# EAGLE design new_power2 (EAGLE 6.4)
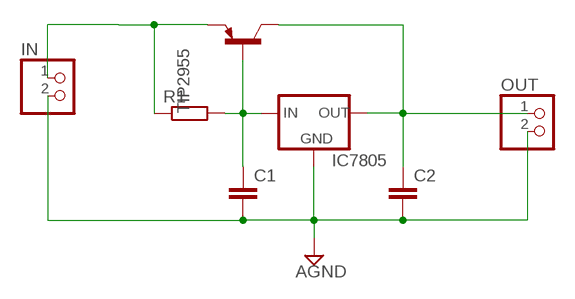
[diagram p0: schematic, sheet 1]

## Parts
C1  C-EU025-024X044  [C025-024X044]
C2  C-EU025-024X044  [C025-024X044]
IC7805  78XXL  [78XXL]
IN  PINHD-1X2  [1X02]
OUT  PINHD-1X2  [1X02]
R1  R-EU_0204/5  [0204/5]
TIP2955  -PNP-TO220  [TO220]

## Nets
AGND: C1.2 C2.2 IC7805.GND IN.2 OUT.2
N$1: IN.1 R1.1 TIP2955.3(E)
N$2: C1.1 IC7805.IN R1.2 TIP2955.1(B)
N$3: C2.1 IC7805.OUT OUT.1 TIP2955.2(C)

## Library data of the parts
C1 C2 = rcl:C-EU: CAPACITOR, European symbol
IC7805 = v-reg:78XXL: VOLTAGE REGULATOR
IN OUT = pinhead:PINHD-1X2: PIN HEADER
R1 = rcl:R-EU_: RESISTOR, European symbol
TIP2955 = transistor:*-PNP-: PNP Transistror

## Board
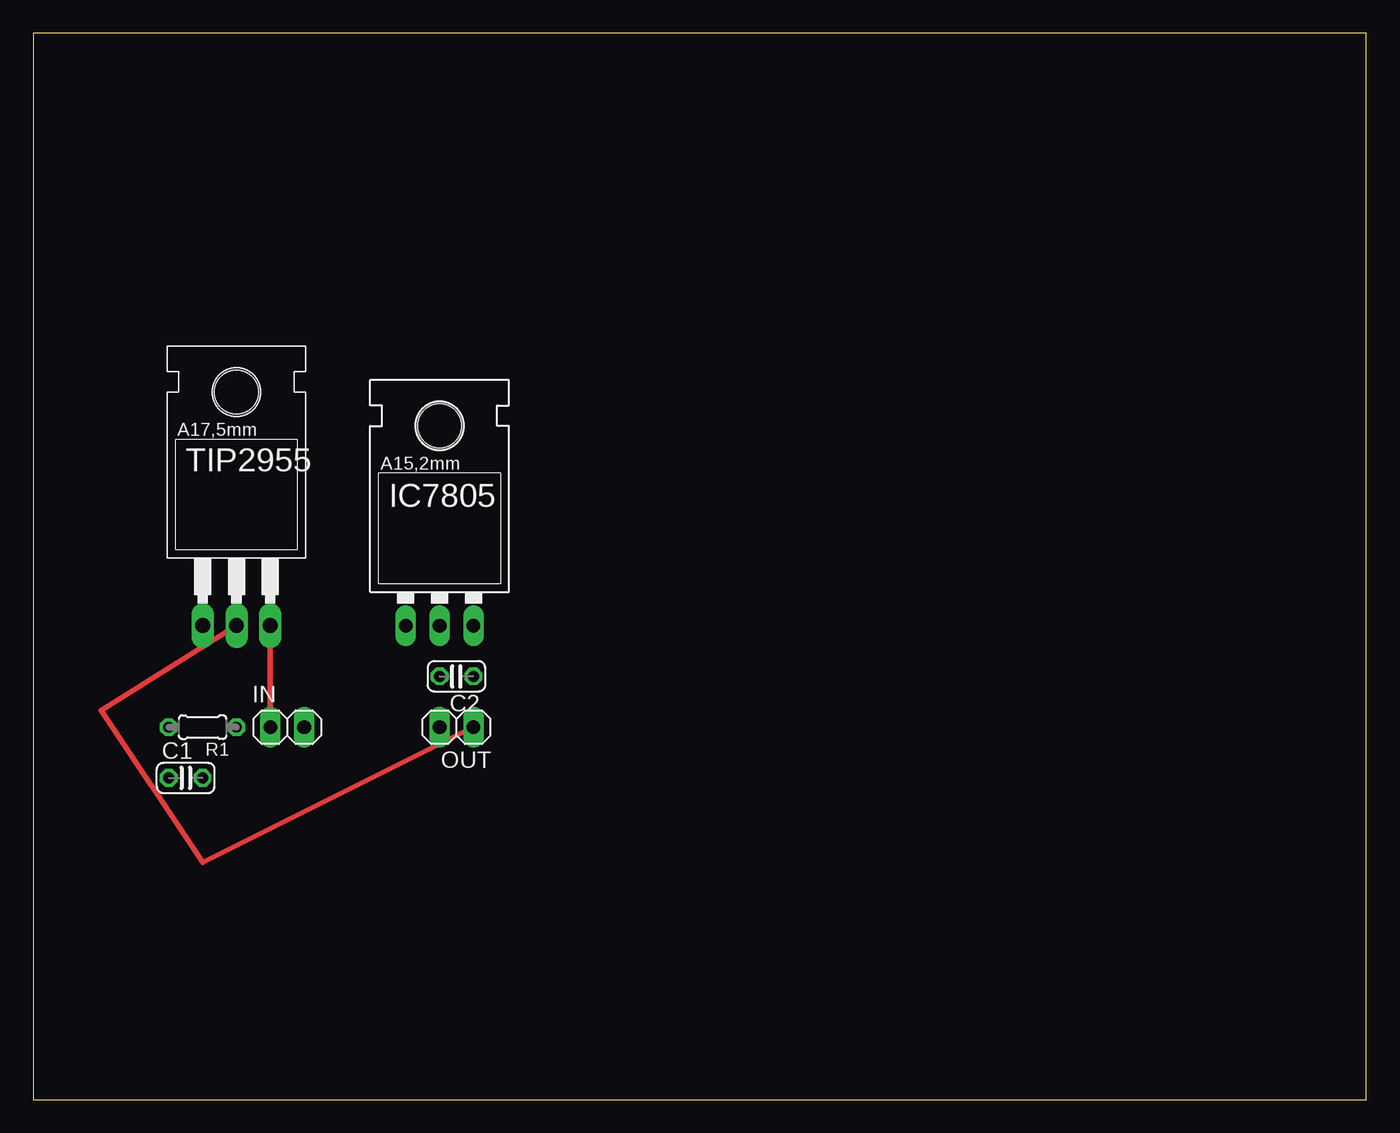
[diagram p1: board, top side]
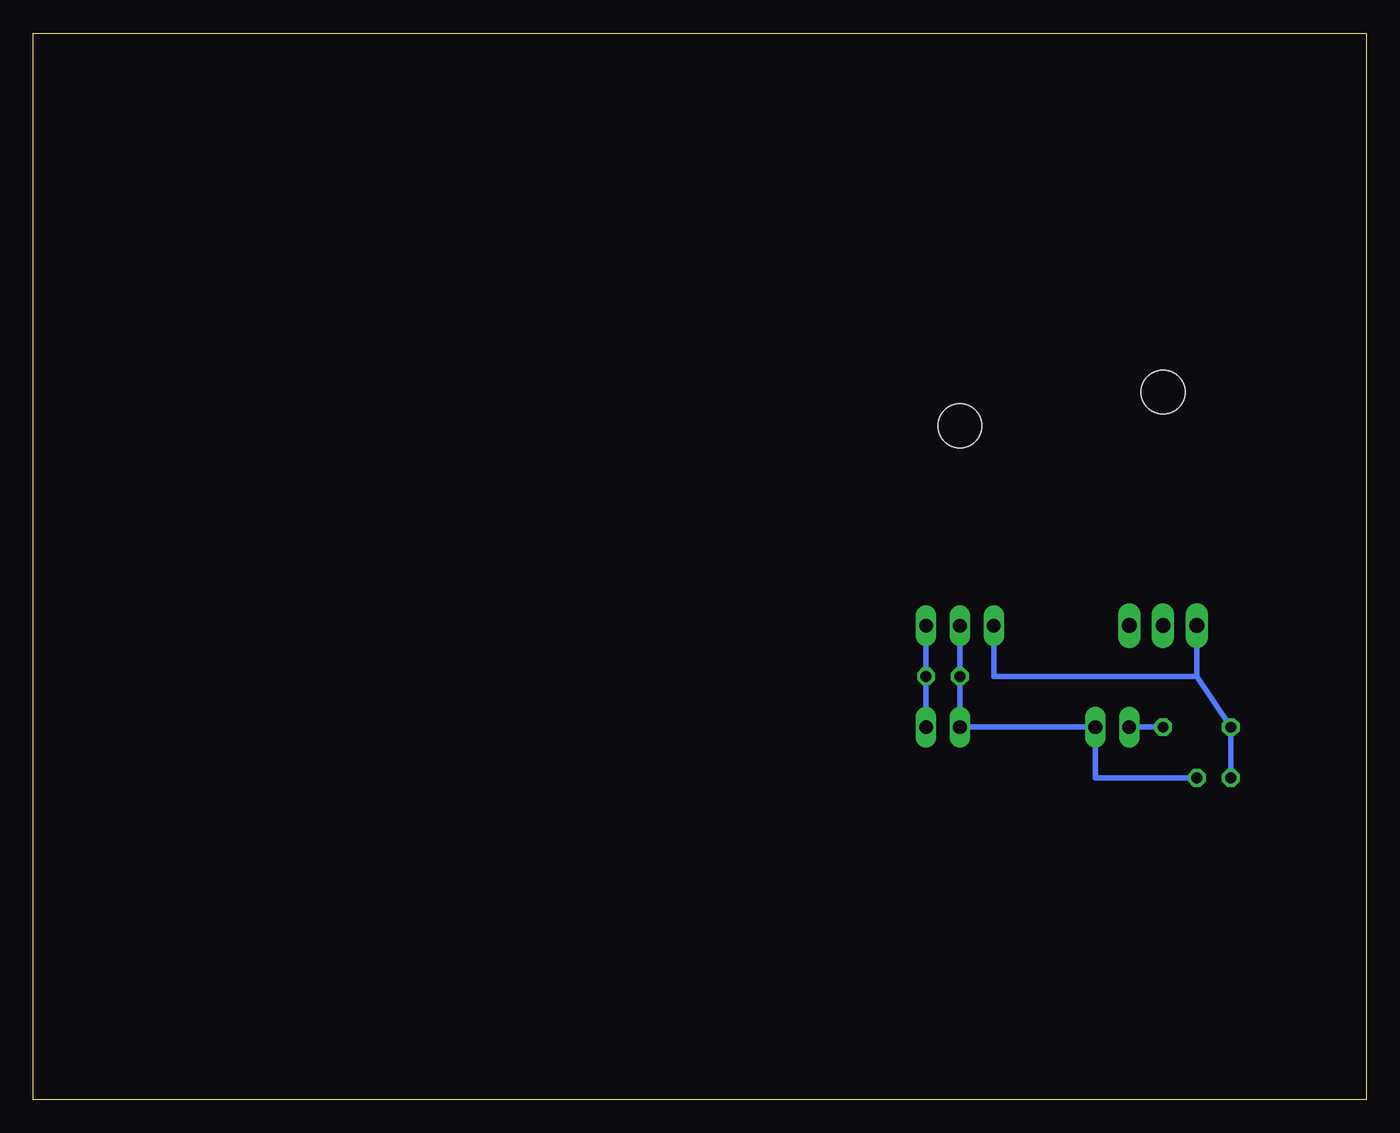
[diagram p2: board, bottom side, seen from below]

Size 100 x 80 mm. Coordinates in mm from the lower left corner, seen from the top.
Outline: 0,0 100,0 100,80 0,80 0,0
Copper layers (1*16): Top 0.035mm / dielectric 1.5mm / Bottom 0.035mm
Design rules "default": minimum track width 10mil, minimum drill 24mil, track to track 8mil, track to pad 8mil, pad to pad 8mil, via to via 8mil, smd to smd 8mil, copper to edge 40mil, drill to drill 8mil, minimum pad ring 10mil, minimum via ring 8mil, stop-mask expansion 4mil, vias tented up to drill 0mil, thermal gap 10mil

### Footprints (pad centres in the part's own frame; a part is rotated, then mirrored left to right if it is on the bottom)
C025-024X044 = drill 0.813 octagon: 1 -1.27,0; 2 1.27,0
78XXL = drill 1.016 long: GND 0,-3.81; IN -2.54,-3.81; OUT 2.54,-3.81 | hole 3.302: 0,11.176
1X02 = drill 1.016 long: 1 -1.27,0; 2 1.27,0
0204/5 = drill 0.813 octagon: 1 -2.54,0; 2 2.54,0
TO220 = drill 1.118 long: 1 -2.54,-6.35; 2 0,-6.35; 3 2.54,-6.35 | hole 3.302: 0,11.176

### Placement (x,y rotation side)
C1  11.43,24.13 0 top
C2  31.75,31.75 180 top
IC7805  30.48,39.37 0 top
IN  19.05,27.94 0 top
OUT  31.75,27.94 180 top
R1  12.7,27.94 180 top
TIP2955  15.24,41.91 0 top

### Tracks (layer width: path | path; a pad name or v marks a point on that pad's centre or on a via)
AGND
  Bottom 0.406: C1.2 20.32,24.13 IN.2 OUT.2 C2.2 IC7805.GND
N$1
  Top 0.406: TIP2955.3 IN.1
  Bottom 0.406: IN.1 R1.1
N$2
  Bottom 0.406: 12.7,31.75 R1.2 C1.1 | TIP2955.1 12.7,31.75 | IC7805.IN 27.94,31.75 12.7,31.75
N$3
  Top 0.406: TIP2955.2 5.08,29.21 12.7,17.78 OUT.1
  Bottom 0.406: IC7805.OUT C2.1 OUT.1